# Altium schematic sheet 2_DDR4_16bits.SchDoc: 2_DDR4_16bits
size A3; Date: Not used; ApprovedBy: Not used; CheckedBy: Not used; Author: Not used; CompanyName: STMicroelectronics; DrawnBy: Not used; Engineer: Not used; Organization: Not used; Address1: Not used; Address2: Not used; Address3: Not used; Address4: Not used; DocumentNumber: Not used; Revision: Not used; SheetNumber: 6; SheetTotal: 7; CurrentTime: Not used; CurrentDate: Not used; Time: Not used; DocumentFullPathAndName: Not used; DocumentName: Not used; ModifiedDate: Not used; ImagePath: Not used; ProjectName: Not used; Application_BuildNumber: Not used
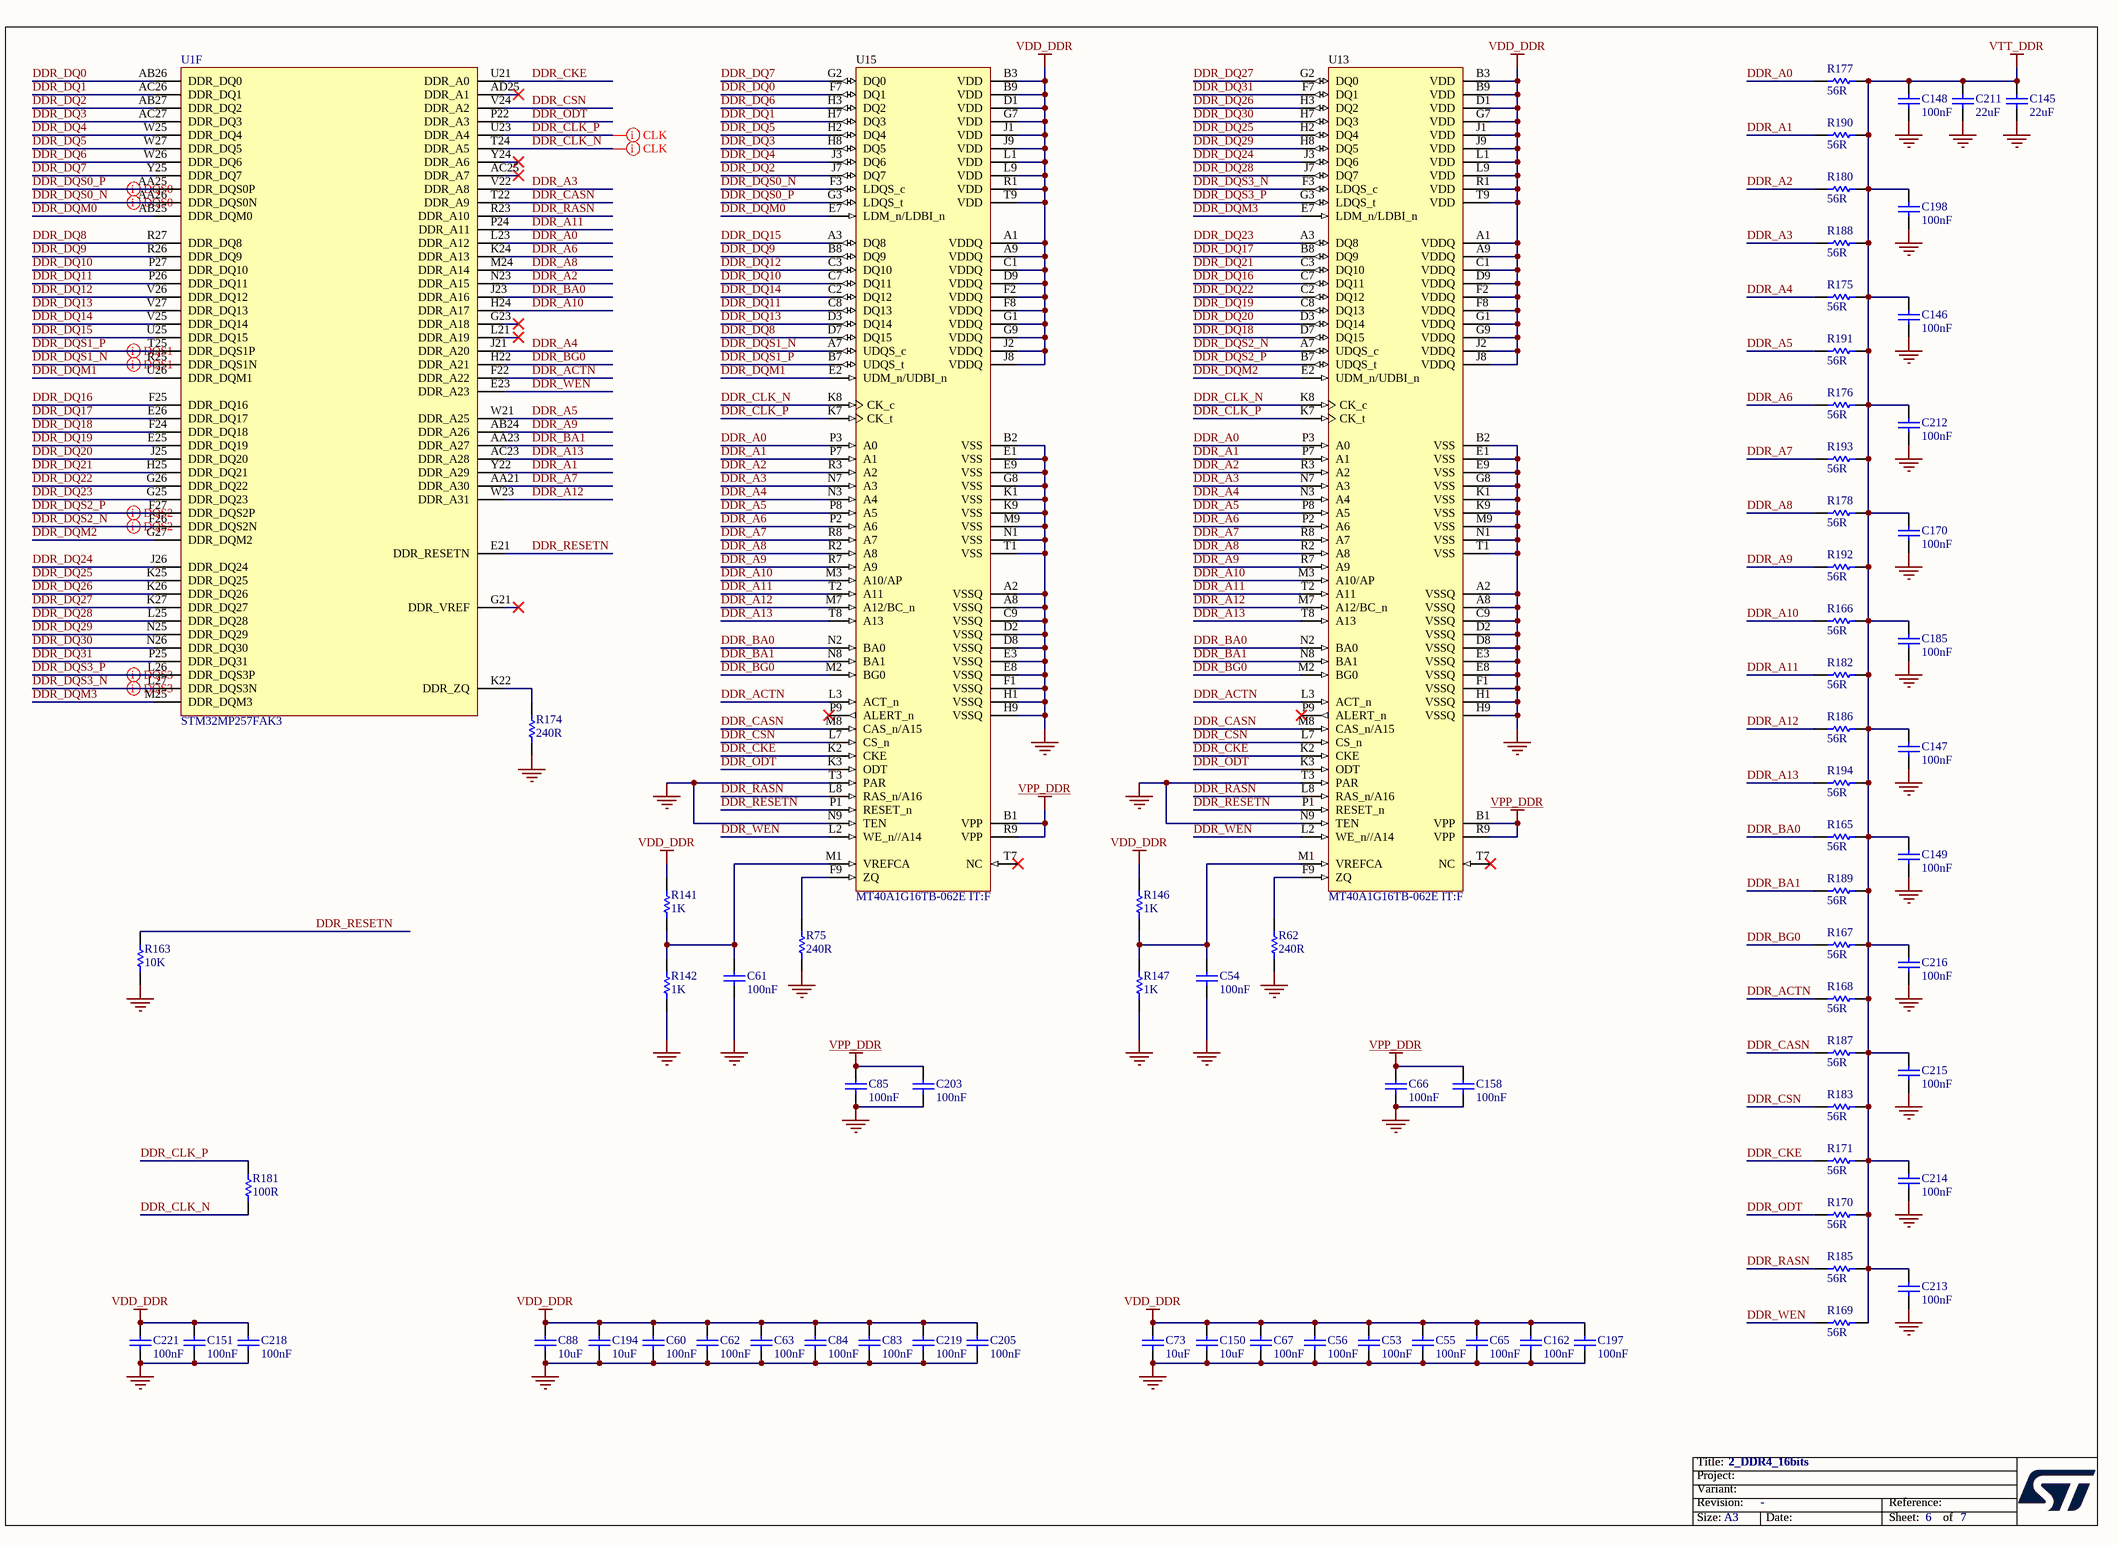
[diagram p0: 2_DDR4_16bits.SchDoc]

## Parts
C53  value 100nF  [C0402]  (hidden comment: Capacitor)
C54  value 100nF  [C0402]  (hidden comment: Capacitor)
C55  value 100nF  [C0402]  (hidden comment: Capacitor)
C56  value 100nF  [C0402]  (hidden comment: Capacitor)
C60  value 100nF  [C0402]  (hidden comment: Capacitor)
C61  value 100nF  [C0402]  (hidden comment: Capacitor)
C62  value 100nF  [C0402]  (hidden comment: Capacitor)
C63  value 100nF  [C0402]  (hidden comment: Capacitor)
C65  value 100nF  [C0402]  (hidden comment: Capacitor)
C66  value 100nF  [C0402]  (hidden comment: Capacitor)
C67  value 100nF  [C0402]  (hidden comment: Capacitor)
C73  value 10uF  [C0603]  (hidden comment: Capacitor)
C83  value 100nF  [C0402]  (hidden comment: Capacitor)
C84  value 100nF  [C0402]  (hidden comment: Capacitor)
C85  value 100nF  [C0402]  (hidden comment: Capacitor)
C88  value 10uF  [C0603]  (hidden comment: Capacitor)
C145  value 22uF  [C0603]  (hidden comment: Capacitor)
C146  value 100nF  [C0402]  (hidden comment: Capacitor)
C147  value 100nF  [C0402]  (hidden comment: Capacitor)
C148  value 100nF  [C0402]  (hidden comment: Capacitor)
C149  value 100nF  [C0402]  (hidden comment: Capacitor)
C150  value 10uF  [C0603]  (hidden comment: Capacitor)
C151  value 100nF  [C0402]  (hidden comment: Capacitor)
C158  value 100nF  [C0402]  (hidden comment: Capacitor)
C162  value 100nF  [C0402]  (hidden comment: Capacitor)
C170  value 100nF  [C0402]  (hidden comment: Capacitor)
C185  value 100nF  [C0402]  (hidden comment: Capacitor)
C194  value 10uF  [C0603]  (hidden comment: Capacitor)
C197  value 100nF  [C0402]  (hidden comment: Capacitor)
C198  value 100nF  [C0402]  (hidden comment: Capacitor)
C203  value 100nF  [C0402]  (hidden comment: Capacitor)
C205  value 100nF  [C0402]  (hidden comment: Capacitor)
C211  value 22uF  [C0603]  (hidden comment: Capacitor)
C212  value 100nF  [C0402]  (hidden comment: Capacitor)
C213  value 100nF  [C0402]  (hidden comment: Capacitor)
C214  value 100nF  [C0402]  (hidden comment: Capacitor)
C215  value 100nF  [C0402]  (hidden comment: Capacitor)
C216  value 100nF  [C0402]  (hidden comment: Capacitor)
C218  value 100nF  [C0402]  (hidden comment: Capacitor)
C219  value 100nF  [C0402]  (hidden comment: Capacitor)
C221  value 100nF  [C0402]  (hidden comment: Capacitor)
R62  value 240R  [R0201_H0P23]  (hidden comment: Resistor)
R75  value 240R  [R0201_H0P23]  (hidden comment: Resistor)
R141  value 1K  [R0402]  (hidden comment: Resistor)
R142  value 1K  [R0402]  (hidden comment: Resistor)
R146  value 1K  [R0402]  (hidden comment: Resistor)
R147  value 1K  [R0402]  (hidden comment: Resistor)
R163  value 10K  [R0402]  (hidden comment: Resistor)
R165  value 56R  [R0402]  (hidden comment: Resistor)
R166  value 56R  [R0402]  (hidden comment: Resistor)
R167  value 56R  [R0402]  (hidden comment: Resistor)
R168  value 56R  [R0402]  (hidden comment: Resistor)
R169  value 56R  [R0402]  (hidden comment: Resistor)
R170  value 56R  [R0402]  (hidden comment: Resistor)
R171  value 56R  [R0402]  (hidden comment: Resistor)
R174  value 240R  [R0201_H0P23]  (hidden comment: Resistor)
R175  value 56R  [R0402]  (hidden comment: Resistor)
R176  value 56R  [R0402]  (hidden comment: Resistor)
R177  value 56R  [R0402]  (hidden comment: Resistor)
R178  value 56R  [R0402]  (hidden comment: Resistor)
R180  value 56R  [R0402]  (hidden comment: Resistor)
R181  value 100R  [R0402]  (hidden comment: Resistor)
R182  value 56R  [R0402]  (hidden comment: Resistor)
R183  value 56R  [R0402]  (hidden comment: Resistor)
R185  value 56R  [R0402]  (hidden comment: Resistor)
R186  value 56R  [R0402]  (hidden comment: Resistor)
R187  value 56R  [R0402]  (hidden comment: Resistor)
R188  value 56R  [R0402]  (hidden comment: Resistor)
R189  value 56R  [R0402]  (hidden comment: Resistor)
R190  value 56R  [R0402]  (hidden comment: Resistor)
R191  value 56R  [R0402]  (hidden comment: Resistor)
R192  value 56R  [R0402]  (hidden comment: Resistor)
R193  value 56R  [R0402]  (hidden comment: Resistor)
R194  value 56R  [R0402]  (hidden comment: Resistor)
U1  STM32MP257FAK3  [ICC_TFBGA424_14X14_P050_H1P20_CODE-B0A2]  (part F of 9)
U13  MT40A1G16TB-062E IT:F  [ICC_FBGA96_TB_7P5X13_P080]
U15  MT40A1G16TB-062E IT:F  [ICC_FBGA96_TB_7P5X13_P080]

## Nets
GND: C53.1 C54.1 C55.1 C56.1 C60.1 C61.1 C62.1 C63.1 C65.1 C66.1 C67.1 C73.1 C83.1 C84.1 C85.1 C88.1 C145.1 C146.1 C147.1 C148.1 C149.1 C150.1 C151.1 C158.1 C162.1 C170.1 C185.1 C194.1 C197.1 C198.1 C203.1 C205.1 C211.1 C212.1 C213.1 C214.1 C215.1 C216.1 C218.1 C219.1 C221.1 R62.1 R75.1 R142.1 R147.1 R163.1 R174.1 U13.A2(VSSQ) U13.A8(VSSQ) U13.B2(VSS) U13.C9(VSSQ) U13.D2(VSSQ) U13.D8(VSSQ) U13.E1(VSS) U13.E3(VSSQ) U13.E8(VSSQ) U13.E9(VSS) U13.F1(VSSQ) U13.G8(VSS) U13.H1(VSSQ) U13.H9(VSSQ) U13.K1(VSS) U13.K9(VSS) U13.M9(VSS) U13.N1(VSS) U13.N9(TEN) U13.T1(VSS) U13.T3(PAR) U15.A2(VSSQ) U15.A8(VSSQ) U15.B2(VSS) U15.C9(VSSQ) U15.D2(VSSQ) U15.D8(VSSQ) U15.E1(VSS) U15.E3(VSSQ) U15.E8(VSSQ) U15.E9(VSS) U15.F1(VSSQ) U15.G8(VSS) U15.H1(VSSQ) U15.H9(VSSQ) U15.K1(VSS) U15.K9(VSS) U15.M9(VSS) U15.N1(VSS) U15.N9(TEN) U15.T1(VSS) U15.T3(PAR)
VDD_DDR: C53.2 C55.2 C56.2 C60.2 C62.2 C63.2 C65.2 C67.2 C73.2 C83.2 C84.2 C88.2 C150.2 C151.2 C162.2 C194.2 C197.2 C205.2 C218.2 C219.2 C221.2 R141.2 R146.2 U13.A1(VDDQ) U13.A9(VDDQ) U13.B3(VDD) U13.B9(VDD) U13.C1(VDDQ) U13.D1(VDD) U13.D9(VDDQ) U13.F2(VDDQ) U13.F8(VDDQ) U13.G1(VDDQ) U13.G7(VDD) U13.G9(VDDQ) U13.J1(VDD) U13.J2(VDDQ) U13.J8(VDDQ) U13.J9(VDD) U13.L1(VDD) U13.L9(VDD) U13.R1(VDD) U13.T9(VDD) U15.A1(VDDQ) U15.A9(VDDQ) U15.B3(VDD) U15.B9(VDD) U15.C1(VDDQ) U15.D1(VDD) U15.D9(VDDQ) U15.F2(VDDQ) U15.F8(VDDQ) U15.G1(VDDQ) U15.G7(VDD) U15.G9(VDDQ) U15.J1(VDD) U15.J2(VDDQ) U15.J8(VDDQ) U15.J9(VDD) U15.L1(VDD) U15.L9(VDD) U15.R1(VDD) U15.T9(VDD)
VPP_DDR: C66.2 C85.2 C158.2 C203.2 U13.B1(VPP) U13.R9(VPP) U15.B1(VPP) U15.R9(VPP)
VTT_DDR: C145.2 C146.2 C147.2 C148.2 C149.2 C170.2 C185.2 C198.2 C211.2 C212.2 C213.2 C214.2 C215.2 C216.2 R165.2 R166.2 R167.2 R168.2 R169.2 R170.2 R171.2 R175.2 R176.2 R177.2 R178.2 R180.2 R182.2 R183.2 R185.2 R186.2 R187.2 R188.2 R189.2 R190.2 R191.2 R192.2 R193.2 R194.2
DDR_A0: R177.1 U1.L23(DDR_A12) U13.P3(A0) U15.P3(A0)
DDR_A1: R190.1 U1.Y22(DDR_A29) U13.P7(A1) U15.P7(A1)
DDR_A2: R180.1 U1.N23(DDR_A15) U13.R3(A2) U15.R3(A2)
DDR_A3: R188.1 U1.V22(DDR_A8) U13.N7(A3) U15.N7(A3)
DDR_A4: R175.1 U1.J21(DDR_A20) U13.N3(A4) U15.N3(A4)
DDR_A5: R191.1 U1.W21(DDR_A25) U13.P8(A5) U15.P8(A5)
DDR_A6: R176.1 U1.K24(DDR_A13) U13.P2(A6) U15.P2(A6)
DDR_A7: R193.1 U1.AA21(DDR_A30) U13.R8(A7) U15.R8(A7)
DDR_A8: R178.1 U1.M24(DDR_A14) U13.R2(A8) U15.R2(A8)
DDR_A9: R192.1 U1.AB24(DDR_A26) U13.R7(A9) U15.R7(A9)
DDR_A10: R166.1 U1.H24(DDR_A17) U13.M3(A10/AP) U15.M3(A10/AP)
DDR_A11: R182.1 U1.P24(DDR_A11) U13.T2(A11) U15.T2(A11)
DDR_A12: R186.1 U1.W23(DDR_A31) U13.M7(A12/BC_n) U15.M7(A12/BC_n)
DDR_A13: R194.1 U1.AC23(DDR_A28) U13.T8(A13) U15.T8(A13)
DDR_ACTN: R168.1 U1.F22(DDR_A22) U13.L3(ACT_n) U15.L3(ACT_n)
DDR_BA0: R165.1 U1.J23(DDR_A16) U13.N2(BA0) U15.N2(BA0)
DDR_BA1: R189.1 U1.AA23(DDR_A27) U13.N8(BA1) U15.N8(BA1)
DDR_BG0: R167.1 U1.H22(DDR_A21) U13.M2(BG0) U15.M2(BG0)
DDR_CASN: R187.1 U1.T22(DDR_A9) U13.M8(CAS_n/A15) U15.M8(CAS_n/A15)
DDR_CKE: R171.1 U1.U21(DDR_A0) U13.K2(CKE) U15.K2(CKE)
DDR_CLK_N: R181.2 U1.T24(DDR_A5) U13.K8(CK_c) U15.K8(CK_c)
DDR_CLK_P: R181.1 U1.U23(DDR_A4) U13.K7(CK_t) U15.K7(CK_t)
DDR_CSN: R183.1 U1.V24(DDR_A2) U13.L7(CS_n) U15.L7(CS_n)
DDR_DQ0: U1.AB26(DDR_DQ0) U15.F7(DQ1)
DDR_DQ1: U1.AC26(DDR_DQ1) U15.H7(DQ3)
DDR_DQ2: U1.AB27(DDR_DQ2) U15.J7(DQ7)
DDR_DQ3: U1.AC27(DDR_DQ3) U15.H8(DQ5)
DDR_DQ4: U1.W25(DDR_DQ4) U15.J3(DQ6)
DDR_DQ5: U1.W27(DDR_DQ5) U15.H2(DQ4)
DDR_DQ6: U1.W26(DDR_DQ6) U15.H3(DQ2)
DDR_DQ7: U1.Y25(DDR_DQ7) U15.G2(DQ0)
DDR_DQ8: U1.R27(DDR_DQ8) U15.D7(DQ15)
DDR_DQ9: U1.R26(DDR_DQ9) U15.B8(DQ9)
DDR_DQ10: U1.P27(DDR_DQ10) U15.C7(DQ11)
DDR_DQ11: U1.P26(DDR_DQ11) U15.C8(DQ13)
DDR_DQ12: U1.V26(DDR_DQ12) U15.C3(DQ10)
DDR_DQ13: U1.V27(DDR_DQ13) U15.D3(DQ14)
DDR_DQ14: U1.V25(DDR_DQ14) U15.C2(DQ12)
DDR_DQ15: U1.U25(DDR_DQ15) U15.A3(DQ8)
DDR_DQ16: U1.F25(DDR_DQ16) U13.C7(DQ11)
DDR_DQ17: U1.E26(DDR_DQ17) U13.B8(DQ9)
DDR_DQ18: U1.F24(DDR_DQ18) U13.D7(DQ15)
DDR_DQ19: U1.E25(DDR_DQ19) U13.C8(DQ13)
DDR_DQ20: U1.J25(DDR_DQ20) U13.D3(DQ14)
DDR_DQ21: U1.H25(DDR_DQ21) U13.C3(DQ10)
DDR_DQ22: U1.G26(DDR_DQ22) U13.C2(DQ12)
DDR_DQ23: U1.G25(DDR_DQ23) U13.A3(DQ8)
DDR_DQ24: U1.J26(DDR_DQ24) U13.J3(DQ6)
DDR_DQ25: U1.K25(DDR_DQ25) U13.H2(DQ4)
DDR_DQ26: U1.K26(DDR_DQ26) U13.H3(DQ2)
DDR_DQ27: U1.K27(DDR_DQ27) U13.G2(DQ0)
DDR_DQ28: U1.L25(DDR_DQ28) U13.J7(DQ7)
DDR_DQ29: U1.N25(DDR_DQ29) U13.H8(DQ5)
DDR_DQ30: U1.N26(DDR_DQ30) U13.H7(DQ3)
DDR_DQ31: U1.P25(DDR_DQ31) U13.F7(DQ1)
DDR_DQM0: U1.AB25(DDR_DQM0) U15.E7(LDM_n/LDBI_n)
DDR_DQM1: U1.U26(DDR_DQM1) U15.E2(UDM_n/UDBI_n)
DDR_DQM2: U1.G27(DDR_DQM2) U13.E2(UDM_n/UDBI_n)
DDR_DQM3: U1.M25(DDR_DQM3) U13.E7(LDM_n/LDBI_n)
DDR_DQS0_N: U1.AA26(DDR_DQS0N) U15.F3(LDQS_c)
DDR_DQS0_P: U1.AA25(DDR_DQS0P) U15.G3(LDQS_t)
DDR_DQS1_N: U1.R25(DDR_DQS1N) U15.A7(UDQS_c)
DDR_DQS1_P: U1.T25(DDR_DQS1P) U15.B7(UDQS_t)
DDR_DQS2_N: U1.F26(DDR_DQS2N) U13.A7(UDQS_c)
DDR_DQS2_P: U1.F27(DDR_DQS2P) U13.B7(UDQS_t)
DDR_DQS3_N: U1.L27(DDR_DQS3N) U13.F3(LDQS_c)
DDR_DQS3_P: U1.L26(DDR_DQS3P) U13.G3(LDQS_t)
DDR_ODT: R170.1 U1.P22(DDR_A3) U13.K3(ODT) U15.K3(ODT)
DDR_RASN: R185.1 U1.R23(DDR_A10) U13.L8(RAS_n/A16) U15.L8(RAS_n/A16)
DDR_RESETN: R163.2 U1.E21(DDR_RESETN) U13.P1(RESET_n) U15.P1(RESET_n)
DDR_WEN: R169.1 U1.E23(DDR_A23) U13.L2(WE_n//A14) U15.L2(WE_n//A14)
NetC54_2: C54.2 R146.1 R147.2 U13.M1(VREFCA)
NetC61_2: C61.2 R141.1 R142.2 U15.M1(VREFCA)
NetR62_2: R62.2 U13.F9(ZQ)
NetR75_2: R75.2 U15.F9(ZQ)
NetR174_2: R174.2 U1.K22(DDR_ZQ)

Not connected (* = marked no-connect by the designer): U1 AC25(DDR_A7)* AD25(DDR_A1)* G21(DDR_VREF)* G23(DDR_A18)* L21(DDR_A19)* Y24(DDR_A6)*; U13 P9(ALERT_n)* T7(NC)*; U15 P9(ALERT_n)* T7(NC)*

## Layout directives
differential pair: DDR_CLK_N, DDR_CLK_P, DDR_DQS0_N, DDR_DQS0_P, DDR_DQS1_N, DDR_DQS1_P, DDR_DQS2_N, DDR_DQS2_P, DDR_DQS3_N, DDR_DQS3_P

## Notes on the sheet
- Title:
- Project:
- Variant:
- Revision:
- Size:
- A3
- -
- Date:
- Reference:
- Sheet:
- of

## Library data of the parts
C53-C56 C60-C63 C65-C67 C83-C85 C146-C149 C151 C158 C162 C170 C185 C197 C198 C203 C205 C212-C216 C218 C219 C221 = MCD-00006: Capacitor, MLCC, 100nF, 16V, X7R, +/-10%, 0402, T=0.5mm; Part_Preference: Recommended; Manufacturer: YAGEO; Manufacturer_Part_Number: CC0402KRX7R7BB104; Alternate_Manufacturer: MURATA; Alternate_Manufacturer_Part_Number: GCM155R71C104KA55D; Order_Code_RS: 616-9701; Internal_Part_Number: MCD-00006; Status: Released; Part_Type: Capacitor; Package: 0402; ComponentLink1Description: Datasheet; ComponentLink1URL: http://tunmcdsvn.tun.st.com/Component_Documentation_Library/Trunk/Capacitor/YAGEO_X7R_Series; Order_Code_Digikey: 311-1338-1-ND; Order_Code_Farnell: 9402047
C73 C88 C150 C194 = MCD-01341: Capacitor, MLCC, 10uF, 6V3, X5R, +/-20%, 0603, T=0,8mm; Part_Preference: Recommended; Manufacturer: MURATA; Manufacturer_Part_Number: GRM188R60J106ME47D; Alternate_Manufacturer_Part_Number: GRM188R60J106ME84D; Internal_Part_Number: MCD-01341; Status: Released; Part_Type: Capacitor; Alternate_Manufacturer: MURATA; Package: 0603; ComponentLink1URL: http://tunmcdsvn.tun.st.com/Component_Documentation_Library/Trunk/Capacitor/MURATA_GRM_Series; Order_Code_Digikey: 490-3896-1-ND; Order_Code_Farnell: 1735528; Order_Code_RS: N/A
C145 C211 = MCD-00100: Capacitor, MLCC, 22uF, 6V3, X5R, +/-20%, 0603, T=0,8mm; Part_Preference: Recommended; Manufacturer: MURATA; Manufacturer_Part_Number: GRM188R60J226MEA0J; Internal_Part_Number: MCD-00100; Status: Released; Part_Type: Capacitor; Package: 0603; ComponentLink1Description: Datasheet; ComponentLink1URL: http://tunmcdsvn.tun.st.com/Component_Documentation_Library/Trunk/Capacitor/MURATA_GRM_Series; Order_Code_Digikey: 490-7612-2-ND; Order_Code_Farnell: N/A; Order_Code_RS: N/A; Alternate_Manufacturer: N/A; Alternate_Manufacturer_Part_Number: N/A
R62 R75 R174 = MCD-02253: Resistor,240R,0201,1%,1/20W; Part_Preference: Recommended; Manufacturer: YAGEO; Manufacturer_Part_Number: RC0201FR-07240RL; Internal_Part_Number: MCD-02253; Status: Checked; Part_Type: Resistor; Alternate_Manufacturer: N/A; Alternate_Manufacturer_Part_Number: N/A; Package: R0201; ComponentLink1URL: http://tunmcdsvn.tun.st.com/Component_Datasheet_Library/Trunk/Resistors/Yageo_Resistor_RC0201-series; Order_Code_Digikey: YAG2528CT-ND; Order_Code_Farnell: N/A; Order_Code_RS: N/A
R141 R142 R146 R147 = MCD-00061: Resistor, 1K, 0402, +/-1%,1/16W; Part_Preference: Recommended; Manufacturer: YAGEO; Manufacturer_Part_Number: RC0402FR-071KL; Order_Code_RS: 9239235; Component_Country_Of_Origin: China; ShowFields: YES; ID: 2532; Internal_Part_Number: MCD-00061; Status: Released; Part_Type: Resistor; Package: 0402; ComponentLink1URL: http://tunmcdsvn.tun.st.com/Component_Documentation_Library/Trunk/Resistor/YAGEO_RC_L_Series; Order_Code_Digikey: 311-1.00KLRCT-ND; Order_Code_Farnell: 9239235
R163 = MCD-00053: Resistor,10K,0402,1%,1/16W; BMS_Part_Number: 9131590; Part_Preference: Recommended; Manufacturer: YAGEO; Manufacturer_Part_Number: RC0402FR-0710KL; Internal_Part_Number: MCD-00053; Status: Released; Part_Type: Resistor; Package: 0402; ComponentLink1Description: Datasheet; ComponentLink1URL: http://tunmcdsvn.tun.st.com/Component_Documentation_Library/Trunk/Resistor/YAGEO_RC_L_Series; Order_Code_Digikey: 311-10.0KLRCT-ND; Order_Code_Farnell: 9239359; Order_Code_RS: N/A; Alternate_Manufacturer: N/A; Alternate_Manufacturer_Part_Number: N/A
R165-R171 R175-R178 R180 R182 R183 R185-R194 = MCD-00054: Resistor, 56R, 0402, +/-1%, 1/16W; Part_Preference: Recommended; Manufacturer: YAGEO; Manufacturer_Part_Number: RC0402FR-0756RL; Internal_Part_Number: MCD-00054; Status: Released; Part_Type: Resistor; Package: 0402; ComponentLink1URL: http://tunmcdsvn.tun.st.com/Component_Documentation_Library/Trunk/Resistor/YAGEO_RC_L_Series; Order_Code_Digikey: 311-56.0LRCT-ND; Order_Code_Farnell: 9239081; Order_Code_RS: N/A; Alternate_Manufacturer: N/A; Alternate_Manufacturer_Part_Number: N/A
R181 = MCD-01819: Resistor,100R,0402,0,5%,1/16W,±100ppm/°C; Part_Preference: Recommended; Manufacturer: YAGEO; Manufacturer_Part_Number: RC0402DR-07100RL; Internal_Part_Number: MCD-01819; Status: Released; Part_Type: Resistor; Package: 0402; ComponentLink1Description: Datasheet; ComponentLink1URL: http://tunmcdsvn.tun.st.com/Component_Documentation_Library/Trunk/Resistor/YAGEO_RC_L_Series; Order_Code_Digikey: RC0402DR-07100RL-ND; Order_Code_Farnell: N/A; Order_Code_RS: N/A; Alternate_Manufacturer: N/A; Alternate_Manufacturer_Part_Number: N/A
U1 = MCD-03375: MPU , 2xCortex-A35@1.5GHz, Cortex-M33@400MHz, TFBGA 14x14, pitch 0.5, 648KB SRAM, With Crypto; Part_Type: IC; Part_Preference: Recommended; Manufacturer: STMICROELECTRONICS; Component_Country_Of_Origin: Unknown; ShowFields: YES; ID: 5491; Value: STM32MP257FAK3; Internal_Part_Number: MCD-03375; Status: Checked; Manufacturer_Part_Number: STM32MP257FAK3; Package: TFBGA; ComponentLink1URL: http://tunmcdsvn.tun.st.com/Component_Documentation_Library/Trunk/IC/STMICROELECTRONICS_STM32MP257FAK3; Order_Code_Digikey: N/A; Order_Code_Farnell: N/A; Order_Code_RS: N/A
U13 U15 = MCD-03523: Memory, DDR4 SDRAM, 1V2, 16Gbit, FBGA96; Part_Type: IC; Part_Preference: Recommended; Manufacturer: MICRON; Component_Country_Of_Origin: Taiwan°; ShowFields: YES; ID: 5639; Internal_Part_Number: MCD-03523; Value: MT40A1G16TB-062E IT:F; Status: Checked; Manufacturer_Part_Number: MT40A1G16TB-062E IT:F; Package: FBGA-96; ComponentLink1URL: http://tunmcdsvn.tun.st.com/Component_Documentation_Library/Trunk/IC/MICRON_MT40A1G16TB-062E-IT-F; Order_Code_Digikey: N/A; Order_Code_Farnell: N/A; Order_Code_RS: N/A